# Altium schematic sheet Control-Principal.V03.R00.SchDoc: Generador Arbitrario DDS
size A3; SheetNumber: 1; SheetTotal: 18
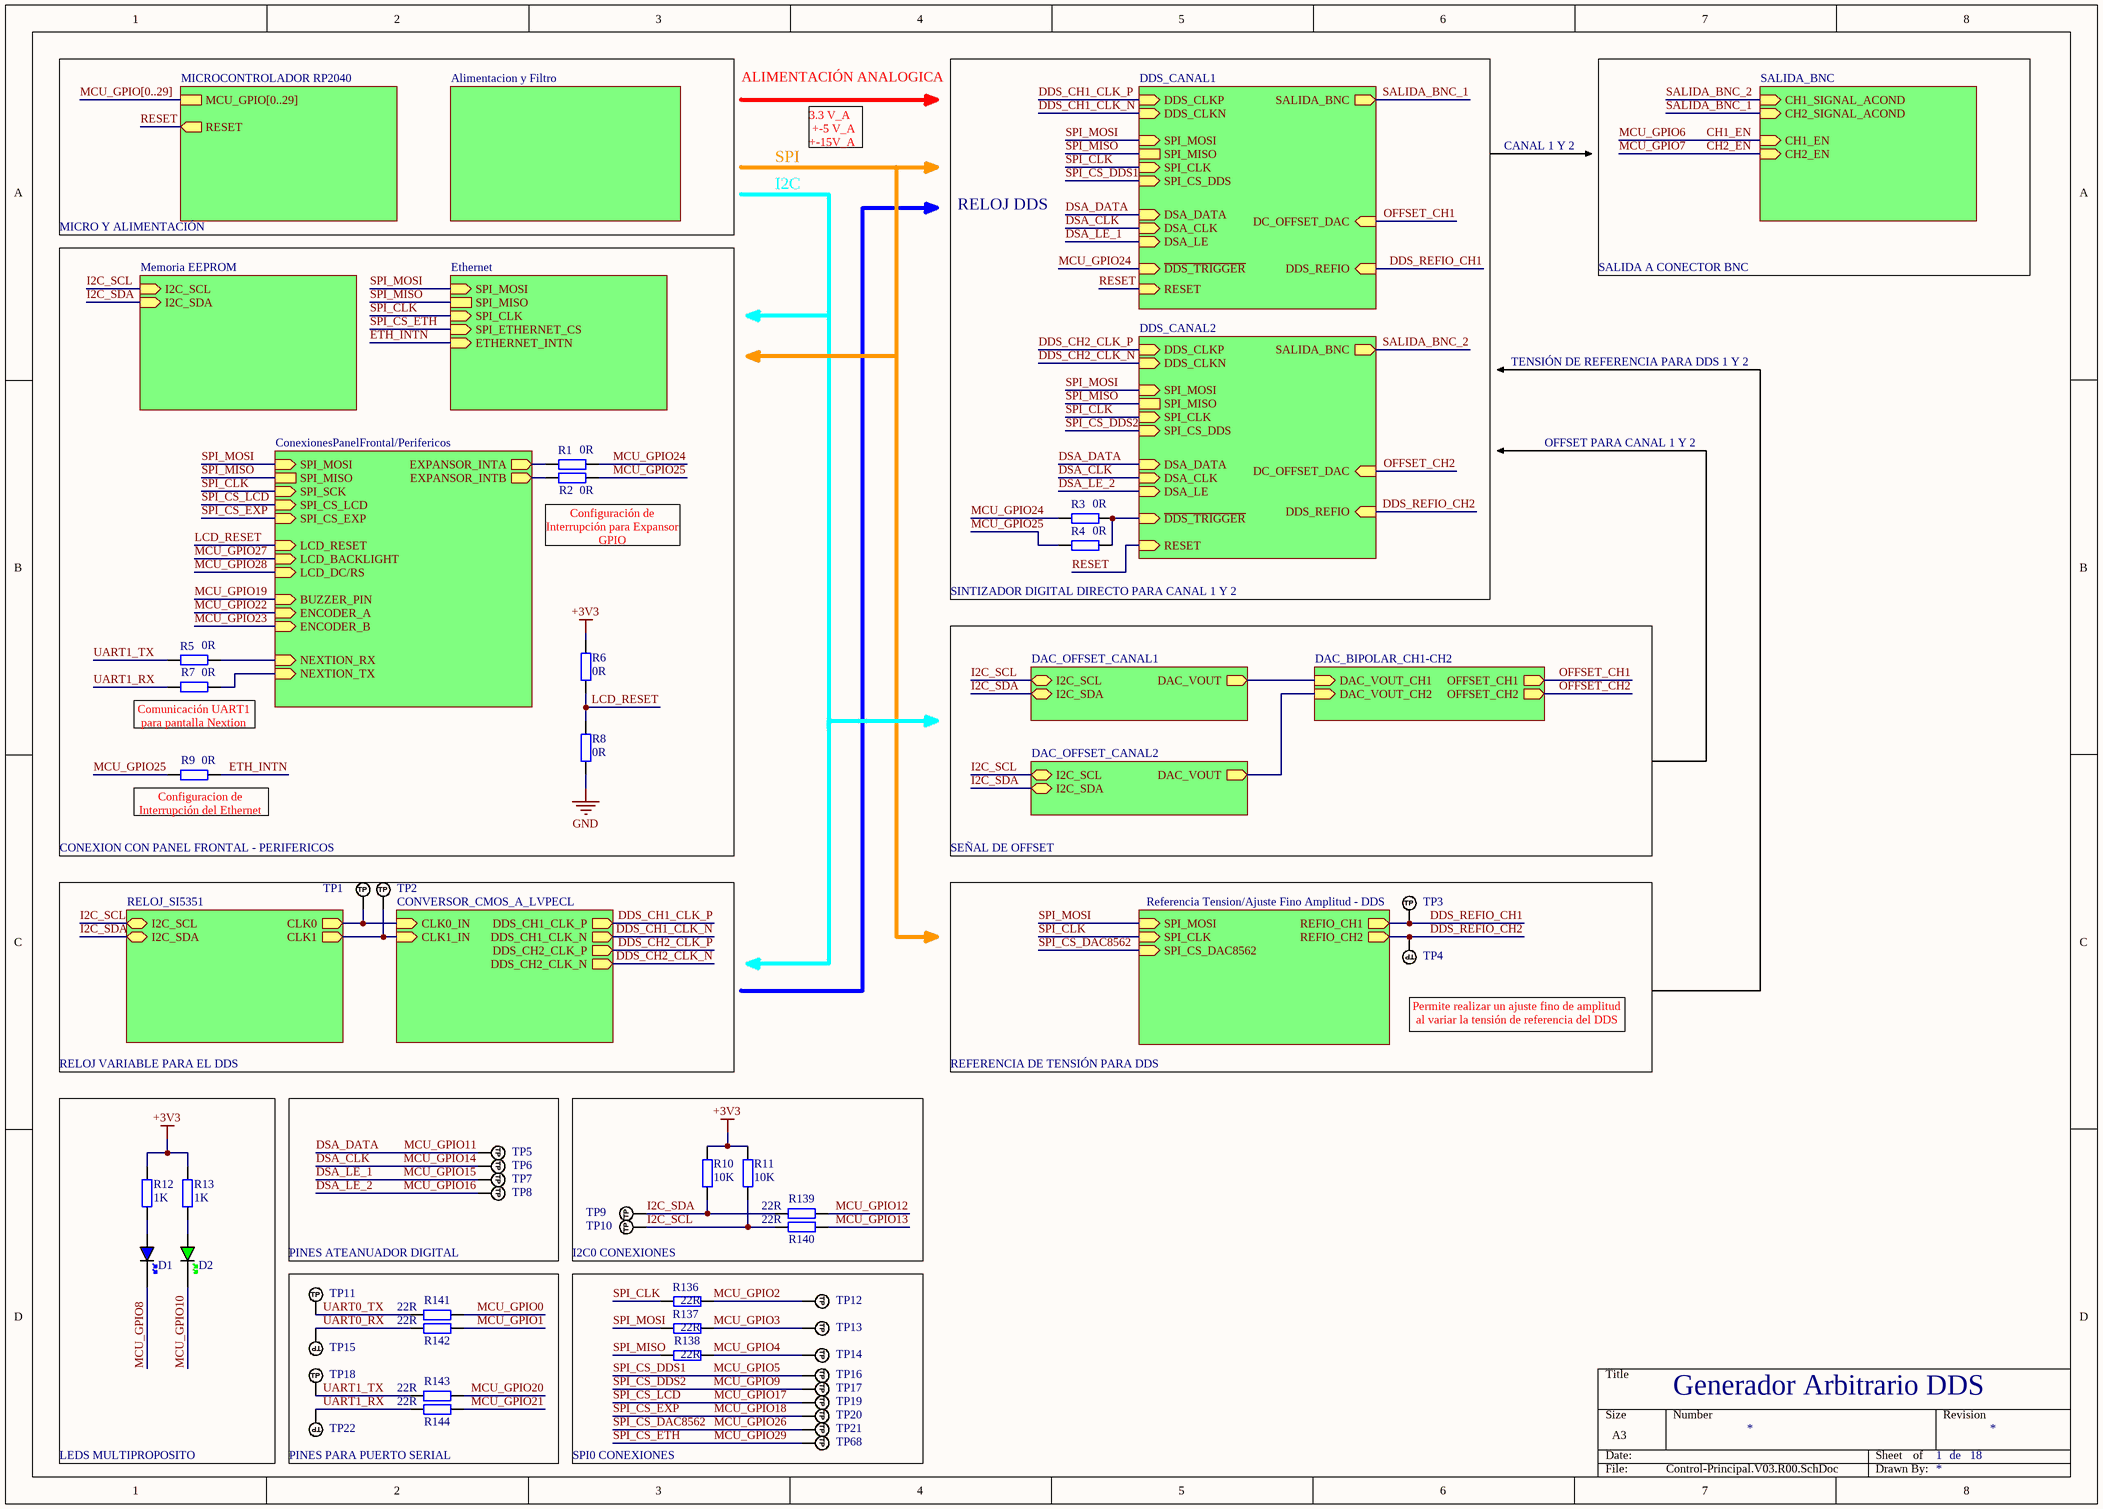
[diagram p0: Control-Principal.V03.R00.SchDoc]

## Parts
D1  BLUE  [LED_0805_BLUE]  (value not drawn)
D2  GREEN  [LED_0805_GREEN]  (value not drawn)
R1  0R  [RES_0805]
R2  0R  [RES_0805]
R3  0R  [RES_0805]
R4  0R  [RES_0805]
R5  0R  [RES_0805]
R6  0R  [RES_0805]
R7  0R  [RES_0805]
R8  0R  [RES_0805]
R9  0R  [RES_0805]
R10  10K  [RES_0805]
R11  10K  [RES_0805]
R12  1K  [RES_0805]
R13  1K  [RES_0805]
R136  22R  [RES_0805]
R137  22R  [RES_0805]
R138  22R  [RES_0805]
R139  22R  [RES_0805]
R140  22R  [RES_0805]
R141  22R  [RES_0805]
R142  22R  [RES_0805]
R143  22R  [RES_0805]
R144  22R  [RES_0805]
TP1  TP_NOBOM  [PAD_RND_1MM]  (value not drawn)  (no BOM)
TP2  TP_NOBOM  [PAD_RND_1MM]  (value not drawn)  (no BOM)
TP3  TP_NOBOM  [PAD_RND_1MM]  (value not drawn)  (no BOM)
TP4  TP_NOBOM  [PAD_RND_1MM]  (value not drawn)  (no BOM)
TP5  TP_NOBOM  [PAD_RND_1MM]  (value not drawn)  (no BOM)
TP6  TP_NOBOM  [PAD_RND_1MM]  (value not drawn)  (no BOM)
TP7  TP_NOBOM  [PAD_RND_1MM]  (value not drawn)  (no BOM)
TP8  TP_NOBOM  [PAD_RND_1MM]  (value not drawn)  (no BOM)
TP9  TP_NOBOM  [PAD_RND_1MM]  (value not drawn)  (no BOM)
TP10  TP_NOBOM  [PAD_RND_1MM]  (value not drawn)  (no BOM)
TP11  TP_NOBOM  [PAD_RND_1MM]  (value not drawn)  (no BOM)
TP12  TP_NOBOM  [PAD_RND_1MM]  (value not drawn)  (no BOM)
TP13  TP_NOBOM  [PAD_RND_1MM]  (value not drawn)  (no BOM)
TP14  TP_NOBOM  [PAD_RND_1MM]  (value not drawn)  (no BOM)
TP15  TP_NOBOM  [PAD_RND_1MM]  (value not drawn)  (no BOM)
TP16  TP_NOBOM  [PAD_RND_1MM]  (value not drawn)  (no BOM)
TP17  TP_NOBOM  [PAD_RND_1MM]  (value not drawn)  (no BOM)
TP18  TP_NOBOM  [PAD_RND_1MM]  (value not drawn)  (no BOM)
TP19  TP_NOBOM  [PAD_RND_1MM]  (value not drawn)  (no BOM)
TP20  TP_NOBOM  [PAD_RND_1MM]  (value not drawn)  (no BOM)
TP21  TP_NOBOM  [PAD_RND_1MM]  (value not drawn)  (no BOM)
TP22  TP_NOBOM  [PAD_RND_1MM]  (value not drawn)  (no BOM)
TP68  TP_NOBOM  [PAD_RND_1MM]  (value not drawn)  (no BOM)

## Blocks framed on the sheet
RELOJ DDS: R3 R4
RELOJ VARIABLE PARA EL DDS: TP1 TP2
REFERENCIA DE TENSIÓN PARA DDS: TP3 TP4
LEDS MULTIPROPOSITO: D1 D2 R12 R13
PINES ATEANUADOR DIGITAL: TP5-TP8
I2C0 CONEXIONES: R10 R11 R139 R140 TP9 TP10
PINES PARA PUERTO SERIAL: R141-R144 TP11 TP15 TP18 TP22
SPI0 CONEXIONES: R136-R138 TP12-TP14 TP16 TP17 TP19-TP21 TP68

## Sub-sheets
Alimentacion y Filtro = Alimentacion.V03.R00.SchDoc: no entries
ConexionesPanelFrontal/Perifericos = ConexionesPanelFrontal.V03.R00.SchDoc: SPI_MOSI (in), SPI_CS_LCD (in), SPI_SCK (in), LCD_DC/RS (in), LCD_RESET (in), LCD_BACKLIGHT (in), EXPANSOR_INTA (out), EXPANSOR_INTB (out), NEXTION_TX (in), NEXTION_RX (in), SPI_CS_EXP (in), BUZZER_PIN (in), ENCODER_A (in), ENCODER_B (in), SPI_MISO
CONVERSOR_CMOS_A_LVPECL = SY55857L.V03.R00.SchDoc: DDS_CH1_CLK_N (out), DDS_CH1_CLK_P (out), DDS_CH2_CLK_P (out), DDS_CH2_CLK_N (out), CLK0_IN (in), CLK1_IN (in)
DAC_BIPOLAR_CH1-CH2 = OPA41971.V03.R00.SchDoc: OFFSET_CH1 (out), DAC_VOUT_CH1 (in), DAC_VOUT_CH2 (in), OFFSET_CH2 (out)
DAC_OFFSET_CANAL1 = MCP4725.V03.R00.SchDoc: DAC_VOUT (out), I2C_SCL (bidir), I2C_SDA (bidir)
DAC_OFFSET_CANAL2 = MCP4725.V03.R00.SchDoc: DAC_VOUT (out), I2C_SCL (bidir), I2C_SDA (bidir)
DDS_CANAL1 = Canal-DDS.V03.R00.SchDoc: DDS_CLKP (in), DDS_CLKN (in), SPI_MOSI (in), SPI_MISO, SPI_CLK (in), SPI_CS_DDS (in), DSA_DATA (in), DSA_CLK (in), DSA_LE (in), DC_OFFSET_DAC (in), SALIDA_BNC (out), ~{DDS_TRIGGER} (in), DDS_REFIO (in), RESET (in)
DDS_CANAL2 = Canal-DDS.V03.R00.SchDoc: DDS_CLKP (in), DDS_CLKN (in), SPI_MOSI (in), SPI_MISO, SPI_CLK (in), SPI_CS_DDS (in), DSA_DATA (in), DSA_CLK (in), DSA_LE (in), DC_OFFSET_DAC (in), SALIDA_BNC (out), ~{DDS_TRIGGER} (in), DDS_REFIO (in), RESET (in)
Ethernet = Ethernet.V03.R00.SchDoc: SPI_MOSI (in), SPI_MISO, SPI_CLK (in), SPI_ETHERNET_CS (in), ETHERNET_INTN (in)
Memoria EEPROM = MemoriaEEPROM.V03.R00.SchDoc: I2C_SCL (in), I2C_SDA (in)
MICROCONTROLADOR RP2040 = Microcontrolador.V03.R00.SchDoc: MCU_GPIO[0..29], RESET (out)
Referencia Tension/Ajuste Fino Amplitud - DDS = ReferenciaTensionDDS.V03.R00.SchDoc: REFIO_CH1 (out), REFIO_CH2 (out), SPI_MOSI (in), SPI_CLK (in), SPI_CS_DAC8562 (in)
RELOJ_SI5351 = SI5351.V03.R00.SchDoc: I2C_SCL (bidir), I2C_SDA (bidir), CLK0 (out), CLK1 (out)
SALIDA_BNC = BNC-OUTPUT.V03.R00.SchDoc: CH1_EN (in), CH1_SIGNAL_ACOND (in), CH2_EN (in), CH2_SIGNAL_ACOND (in)

## Nets
+3V3: R6.1 R10.2 R11.2 R12.2 R13.2
GND: R8.1
CH1_EN: sheet SALIDA_BNC/CH1_EN  [also labelled MCU_GPIO6]
CH2_EN: sheet SALIDA_BNC/CH2_EN  [also labelled MCU_GPIO7]
DDS_CH1_CLK_N: sheet DDS_CANAL1/DDS_CLKN, sheet CONVERSOR_CMOS_A_LVPECL/DDS_CH1_CLK_N
DDS_CH1_CLK_P: sheet DDS_CANAL1/DDS_CLKP, sheet CONVERSOR_CMOS_A_LVPECL/DDS_CH1_CLK_P
DDS_CH2_CLK_N: sheet CONVERSOR_CMOS_A_LVPECL/DDS_CH2_CLK_N, sheet DDS_CANAL2/DDS_CLKN
DDS_CH2_CLK_P: sheet CONVERSOR_CMOS_A_LVPECL/DDS_CH2_CLK_P, sheet DDS_CANAL2/DDS_CLKP
DDS_REFIO_CH1: TP3.1(TP) ; sheet DDS_CANAL1/DDS_REFIO, sheet Referencia Tension/Ajuste Fino Amplitud - DDS/REFIO_CH1
DDS_REFIO_CH2: TP4.1(TP) ; sheet DDS_CANAL2/DDS_REFIO, sheet Referencia Tension/Ajuste Fino Amplitud - DDS/REFIO_CH2
DSA_CLK: TP6.1(TP) ; sheet DDS_CANAL1/DSA_CLK, sheet DDS_CANAL2/DSA_CLK  [also labelled MCU_GPIO14]
DSA_DATA: TP5.1(TP) ; sheet DDS_CANAL1/DSA_DATA, sheet DDS_CANAL2/DSA_DATA  [also labelled MCU_GPIO11]
DSA_LE_1: TP7.1(TP) ; sheet DDS_CANAL1/DSA_LE  [also labelled MCU_GPIO15]
DSA_LE_2: TP8.1(TP) ; sheet DDS_CANAL2/DSA_LE  [also labelled MCU_GPIO16]
ETH_INTN: R9.2 ; sheet Ethernet/ETHERNET_INTN
I2C_SCL: R11.1 R140.1 TP10.1(TP) ; sheet RELOJ_SI5351/I2C_SCL, sheet DAC_OFFSET_CANAL1/I2C_SCL, sheet DAC_OFFSET_CANAL2/I2C_SCL, sheet Memoria EEPROM/I2C_SCL
I2C_SDA: R10.1 R139.1 TP9.1(TP) ; sheet RELOJ_SI5351/I2C_SDA, sheet DAC_OFFSET_CANAL1/I2C_SDA, sheet DAC_OFFSET_CANAL2/I2C_SDA, sheet Memoria EEPROM/I2C_SDA
LCD_RESET: R6.2 R8.2 ; sheet ConexionesPanelFrontal/Perifericos/LCD_RESET
MCU_GPIO0: R141.2
MCU_GPIO1: R142.2
MCU_GPIO2: R136.2 TP12.1(TP)
MCU_GPIO3: R137.2 TP13.1(TP)
MCU_GPIO4: R138.2 TP14.1(TP)
MCU_GPIO5: TP16.1(TP) ; sheet DDS_CANAL1/SPI_CS_DDS  [also labelled SPI_CS_DDS1]
MCU_GPIO8: D1.K
MCU_GPIO9: TP17.1(TP) ; sheet DDS_CANAL2/SPI_CS_DDS  [also labelled SPI_CS_DDS2]
MCU_GPIO10: D2.K
MCU_GPIO12: R139.2
MCU_GPIO13: R140.2
MCU_GPIO17: TP19.1(TP) ; sheet ConexionesPanelFrontal/Perifericos/SPI_CS_LCD  [also labelled SPI_CS_LCD]
MCU_GPIO18: TP20.1(TP) ; sheet ConexionesPanelFrontal/Perifericos/SPI_CS_EXP  [also labelled SPI_CS_EXP]
MCU_GPIO19: sheet ConexionesPanelFrontal/Perifericos/BUZZER_PIN
MCU_GPIO20: R143.2
MCU_GPIO21: R144.2
MCU_GPIO22: sheet ConexionesPanelFrontal/Perifericos/ENCODER_A
MCU_GPIO23: sheet ConexionesPanelFrontal/Perifericos/ENCODER_B
MCU_GPIO24: R1.2 R3.1 ; sheet DDS_CANAL1/~{DDS_TRIGGER}
MCU_GPIO25: R2.2 R4.1 R9.1
MCU_GPIO26: TP21.1(TP) ; sheet Referencia Tension/Ajuste Fino Amplitud - DDS/SPI_CS_DAC8562  [also labelled SPI_CS_DAC8562]
MCU_GPIO27: sheet ConexionesPanelFrontal/Perifericos/LCD_BACKLIGHT
MCU_GPIO28: sheet ConexionesPanelFrontal/Perifericos/LCD_DC/RS
MCU_GPIO29: TP68.1(TP) ; sheet Ethernet/SPI_ETHERNET_CS  [also labelled SPI_CS_ETH]
OFFSET_CH1: sheet DDS_CANAL1/DC_OFFSET_DAC, sheet DAC_BIPOLAR_CH1-CH2/OFFSET_CH1
OFFSET_CH2: sheet DAC_BIPOLAR_CH1-CH2/OFFSET_CH2, sheet DDS_CANAL2/DC_OFFSET_DAC
RESET: sheet MICROCONTROLADOR RP2040/RESET, sheet DDS_CANAL1/RESET, sheet DDS_CANAL2/RESET
SALIDA_BNC_1: sheet DDS_CANAL1/SALIDA_BNC, sheet SALIDA_BNC/CH2_SIGNAL_ACOND
SALIDA_BNC_2: sheet SALIDA_BNC/CH1_SIGNAL_ACOND, sheet DDS_CANAL2/SALIDA_BNC
SPI_CLK: R136.1 ; sheet DDS_CANAL1/SPI_CLK, sheet DDS_CANAL2/SPI_CLK, sheet ConexionesPanelFrontal/Perifericos/SPI_SCK, sheet Referencia Tension/Ajuste Fino Amplitud - DDS/SPI_CLK, sheet Ethernet/SPI_CLK
SPI_MISO: R138.1 ; sheet DDS_CANAL1/SPI_MISO, sheet DDS_CANAL2/SPI_MISO, sheet ConexionesPanelFrontal/Perifericos/SPI_MISO, sheet Ethernet/SPI_MISO
SPI_MOSI: R137.1 ; sheet DDS_CANAL1/SPI_MOSI, sheet DDS_CANAL2/SPI_MOSI, sheet ConexionesPanelFrontal/Perifericos/SPI_MOSI, sheet Referencia Tension/Ajuste Fino Amplitud - DDS/SPI_MOSI, sheet Ethernet/SPI_MOSI
UART0_RX: R142.1 TP15.1(TP)
UART0_TX: R141.1 TP11.1(TP)
UART1_RX: R7.1 R144.1 TP22.1(TP)
UART1_TX: R5.1 R143.1 TP18.1(TP)
NetD1_A: D1.A R12.1
NetD2_A: D2.A R13.1
NetR1_1: R1.1 ; sheet ConexionesPanelFrontal/Perifericos/EXPANSOR_INTA
NetR2_1: R2.1 ; sheet ConexionesPanelFrontal/Perifericos/EXPANSOR_INTB
NetR3_2: R3.2 R4.2 ; sheet DDS_CANAL2/~{DDS_TRIGGER}
NetR5_2: R5.2 ; sheet ConexionesPanelFrontal/Perifericos/NEXTION_RX
NetR7_2: R7.2 ; sheet ConexionesPanelFrontal/Perifericos/NEXTION_TX
NetTP1_1: TP1.1(TP) ; sheet RELOJ_SI5351/CLK0, sheet CONVERSOR_CMOS_A_LVPECL/CLK0_IN
NetTP2_1: TP2.1(TP) ; sheet RELOJ_SI5351/CLK1, sheet CONVERSOR_CMOS_A_LVPECL/CLK1_IN
(unnamed): sheet DAC_OFFSET_CANAL1/DAC_VOUT, sheet DAC_BIPOLAR_CH1-CH2/DAC_VOUT_CH1
(unnamed): sheet DAC_BIPOLAR_CH1-CH2/DAC_VOUT_CH2, sheet DAC_OFFSET_CANAL2/DAC_VOUT

## Buses and harness runs
bus MCU_GPIO[0..29] = sheet MICROCONTROLADOR RP2040/MCU_GPIO[0..29]

## Notes on the sheet
- ALIMENTACIÓN ANALOGICA
- SPI
- 3.3 V_A
  +-5 V_A
  +-15V_A
- CANAL 1 Y 2
- MICRO Y ALIMENTACIÓN
- I2C
- SALIDA A CONECTOR BNC
- TENSIÓN DE REFERENCIA PARA DDS 1 Y 2
- OFFSET PARA CANAL 1 Y 2
- Configuración de Interrupción para Expansor GPIO
- (near R4) SINTIZADOR DIGITAL DIRECTO PARA CANAL 1 Y 2
- (near R7) Comunicación UART1 para pantalla Nextion
- CONEXION CON PANEL FRONTAL - PERIFERICOS
- (near R9) Configuracion de Interrupción del Ethernet
- SEÑAL DE OFFSET
- (near TP4) Permite realizar un ajuste fino de amplitud al variar la tensión de referencia del DDS
- de

## Library data of the parts
D1 = LED_0805_BLUE: LED 0805 BLUE SMD; Manufacturer: *; Manufacturer Part Number: *; Distributor Link: *; LCSC: *
D2 = LED_0805_GREEN: LED 0805 GREEN SMD; Manufacturer: *; Manufacturer Part Number: *; Distributor Link: *; LCSC: *
R1-R13 R136-R144 = RES_0805: Resistor SMD 0805; Manufacturer: *; Manufacturer Part Number: *; Distributor Link: *; LCSC: *
TP1-TP22 TP68 = TEST_POINT_RND_1MM: Test Point Round 1mm (NO BOM)